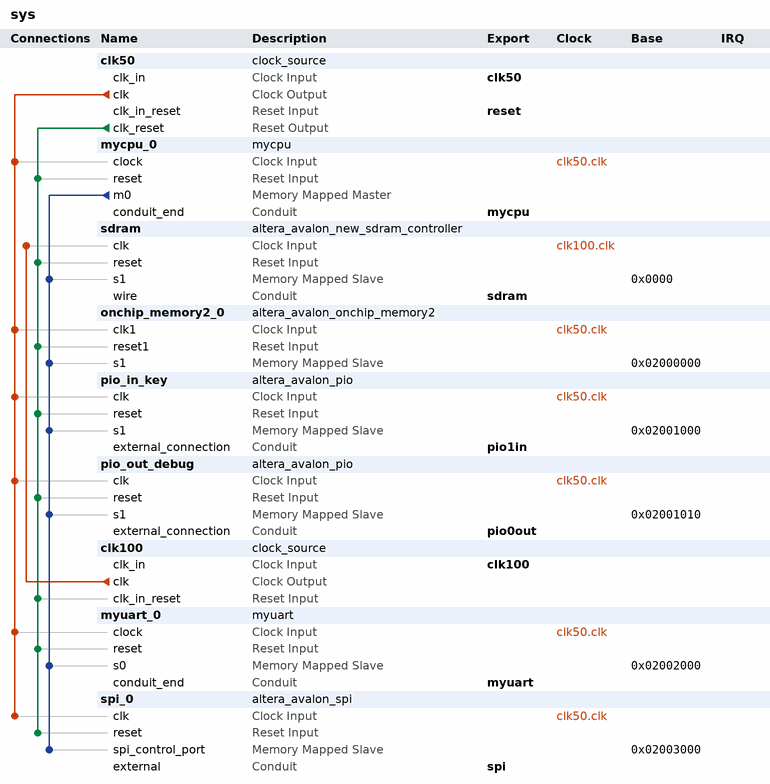
[diagram p0: system contents]
# Platform Designer (Qsys) system sys, Cyclone IV E EP4CE15F23C8
# Parameters at their usual value, and those the tool derives, are not listed.
package require -exact qsys 13.0.1.99.2
create_system sys
set_project_property DEVICE_FAMILY {Cyclone IV E}
set_project_property DEVICE EP4CE15F23C8

add_instance clk50 clock_source 13.0
set_instance_parameter_value clk50 clockFrequency 50000000

add_instance mycpu_0 mycpu 1.0

add_instance sdram altera_avalon_new_sdram_controller 13.0.1.99.2
set_instance_parameter_value sdram TAC 5.5
set_instance_parameter_value sdram TRCD 20.0
set_instance_parameter_value sdram TRFC 60.0
set_instance_parameter_value sdram TRP 20.0
set_instance_parameter_value sdram casLatency 2
set_instance_parameter_value sdram columnWidth 9
set_instance_parameter_value sdram dataWidth 16
set_instance_parameter_value sdram generateSimulationModel false
set_instance_parameter_value sdram initRefreshCommands 8
set_instance_parameter_value sdram model single_Micron_MT48LC4M32B2_7_chip
set_instance_parameter_value sdram numberOfBanks 4
set_instance_parameter_value sdram numberOfChipSelects 1
set_instance_parameter_value sdram powerUpDelay 200.0
set_instance_parameter_value sdram refreshPeriod 7.8125
set_instance_parameter_value sdram rowWidth 13

add_instance onchip_memory2_0 altera_avalon_onchip_memory2 13.0.1.99.2
set_instance_parameter_value onchip_memory2_0 dataWidth 32
set_instance_parameter_value onchip_memory2_0 dualPort false
set_instance_parameter_value onchip_memory2_0 initMemContent true
set_instance_parameter_value onchip_memory2_0 initializationFileName out.hex
set_instance_parameter_value onchip_memory2_0 memorySize 4096
set_instance_parameter_value onchip_memory2_0 useNonDefaultInitFile true

add_instance pio_in_key altera_avalon_pio 13.0.1.99.2
set_instance_parameter_value pio_in_key direction Input
set_instance_parameter_value pio_in_key width 8

add_instance pio_out_debug altera_avalon_pio 13.0.1.99.2
set_instance_parameter_value pio_out_debug direction Output
set_instance_parameter_value pio_out_debug width 32

add_instance clk100 clock_source 13.0
set_instance_parameter_value clk100 clockFrequency 100000000

add_instance myuart_0 myuart 1.0

add_instance spi_0 altera_avalon_spi 13.0.1.99.2
set_instance_parameter_value spi_0 clockPolarity 0
set_instance_parameter_value spi_0 dataWidth 8
set_instance_parameter_value spi_0 masterSPI true
set_instance_parameter_value spi_0 numberOfSlaves 1
set_instance_parameter_value spi_0 targetClockRate 1000000

# connections
add_connection clk50.clk mycpu_0.clock clock
add_connection clk50.clk myuart_0.clock clock
add_connection clk50.clk onchip_memory2_0.clk1 clock
add_connection clk50.clk pio_in_key.clk clock
add_connection clk50.clk pio_out_debug.clk clock
add_connection clk50.clk spi_0.clk clock
add_connection clk100.clk sdram.clk clock
add_connection clk50.clk_reset clk100.clk_in_reset reset
add_connection clk50.clk_reset mycpu_0.reset reset
add_connection clk50.clk_reset myuart_0.reset reset
add_connection clk50.clk_reset onchip_memory2_0.reset1 reset
add_connection clk50.clk_reset pio_in_key.reset reset
add_connection clk50.clk_reset pio_out_debug.reset reset
add_connection clk50.clk_reset sdram.reset reset
add_connection clk50.clk_reset spi_0.reset reset
add_connection mycpu_0.m0 myuart_0.s0 avalon
set_connection_parameter_value mycpu_0.m0/myuart_0.s0 baseAddress 0x02002000
add_connection mycpu_0.m0 onchip_memory2_0.s1 avalon
set_connection_parameter_value mycpu_0.m0/onchip_memory2_0.s1 baseAddress 0x02000000
add_connection mycpu_0.m0 pio_in_key.s1 avalon
set_connection_parameter_value mycpu_0.m0/pio_in_key.s1 baseAddress 0x02001000
add_connection mycpu_0.m0 pio_out_debug.s1 avalon
set_connection_parameter_value mycpu_0.m0/pio_out_debug.s1 baseAddress 0x02001010
add_connection mycpu_0.m0 sdram.s1 avalon
set_connection_parameter_value mycpu_0.m0/sdram.s1 baseAddress 0x0000
add_connection mycpu_0.m0 spi_0.spi_control_port avalon
set_connection_parameter_value mycpu_0.m0/spi_0.spi_control_port baseAddress 0x02003000

# exported interfaces
add_interface clk50 clock sink
set_interface_property clk50 EXPORT_OF clk50.clk_in
add_interface pio0out conduit end
set_interface_property pio0out EXPORT_OF pio_out_debug.external_connection
add_interface pio1in conduit end
set_interface_property pio1in EXPORT_OF pio_in_key.external_connection
add_interface reset reset sink
set_interface_property reset EXPORT_OF clk50.clk_in_reset
add_interface mycpu conduit end
set_interface_property mycpu EXPORT_OF mycpu_0.conduit_end
add_interface clk100 clock sink
set_interface_property clk100 EXPORT_OF clk100.clk_in
add_interface sdram conduit end
set_interface_property sdram EXPORT_OF sdram.wire
add_interface myuart conduit end
set_interface_property myuart EXPORT_OF myuart_0.conduit_end
add_interface spi conduit end
set_interface_property spi EXPORT_OF spi_0.external

set_interconnect_requirement {$system} qsys_mm.clockCrossingAdapter HANDSHAKE
set_interconnect_requirement {$system} qsys_mm.maxAdditionalLatency 1

save_system sys.qsys
